# Altium schematic sheet 15_ISP.SchDoc: SPCA2688 ISP
size C; DocumentNumber: 9; SheetNumber: 9; SheetTotal: 12
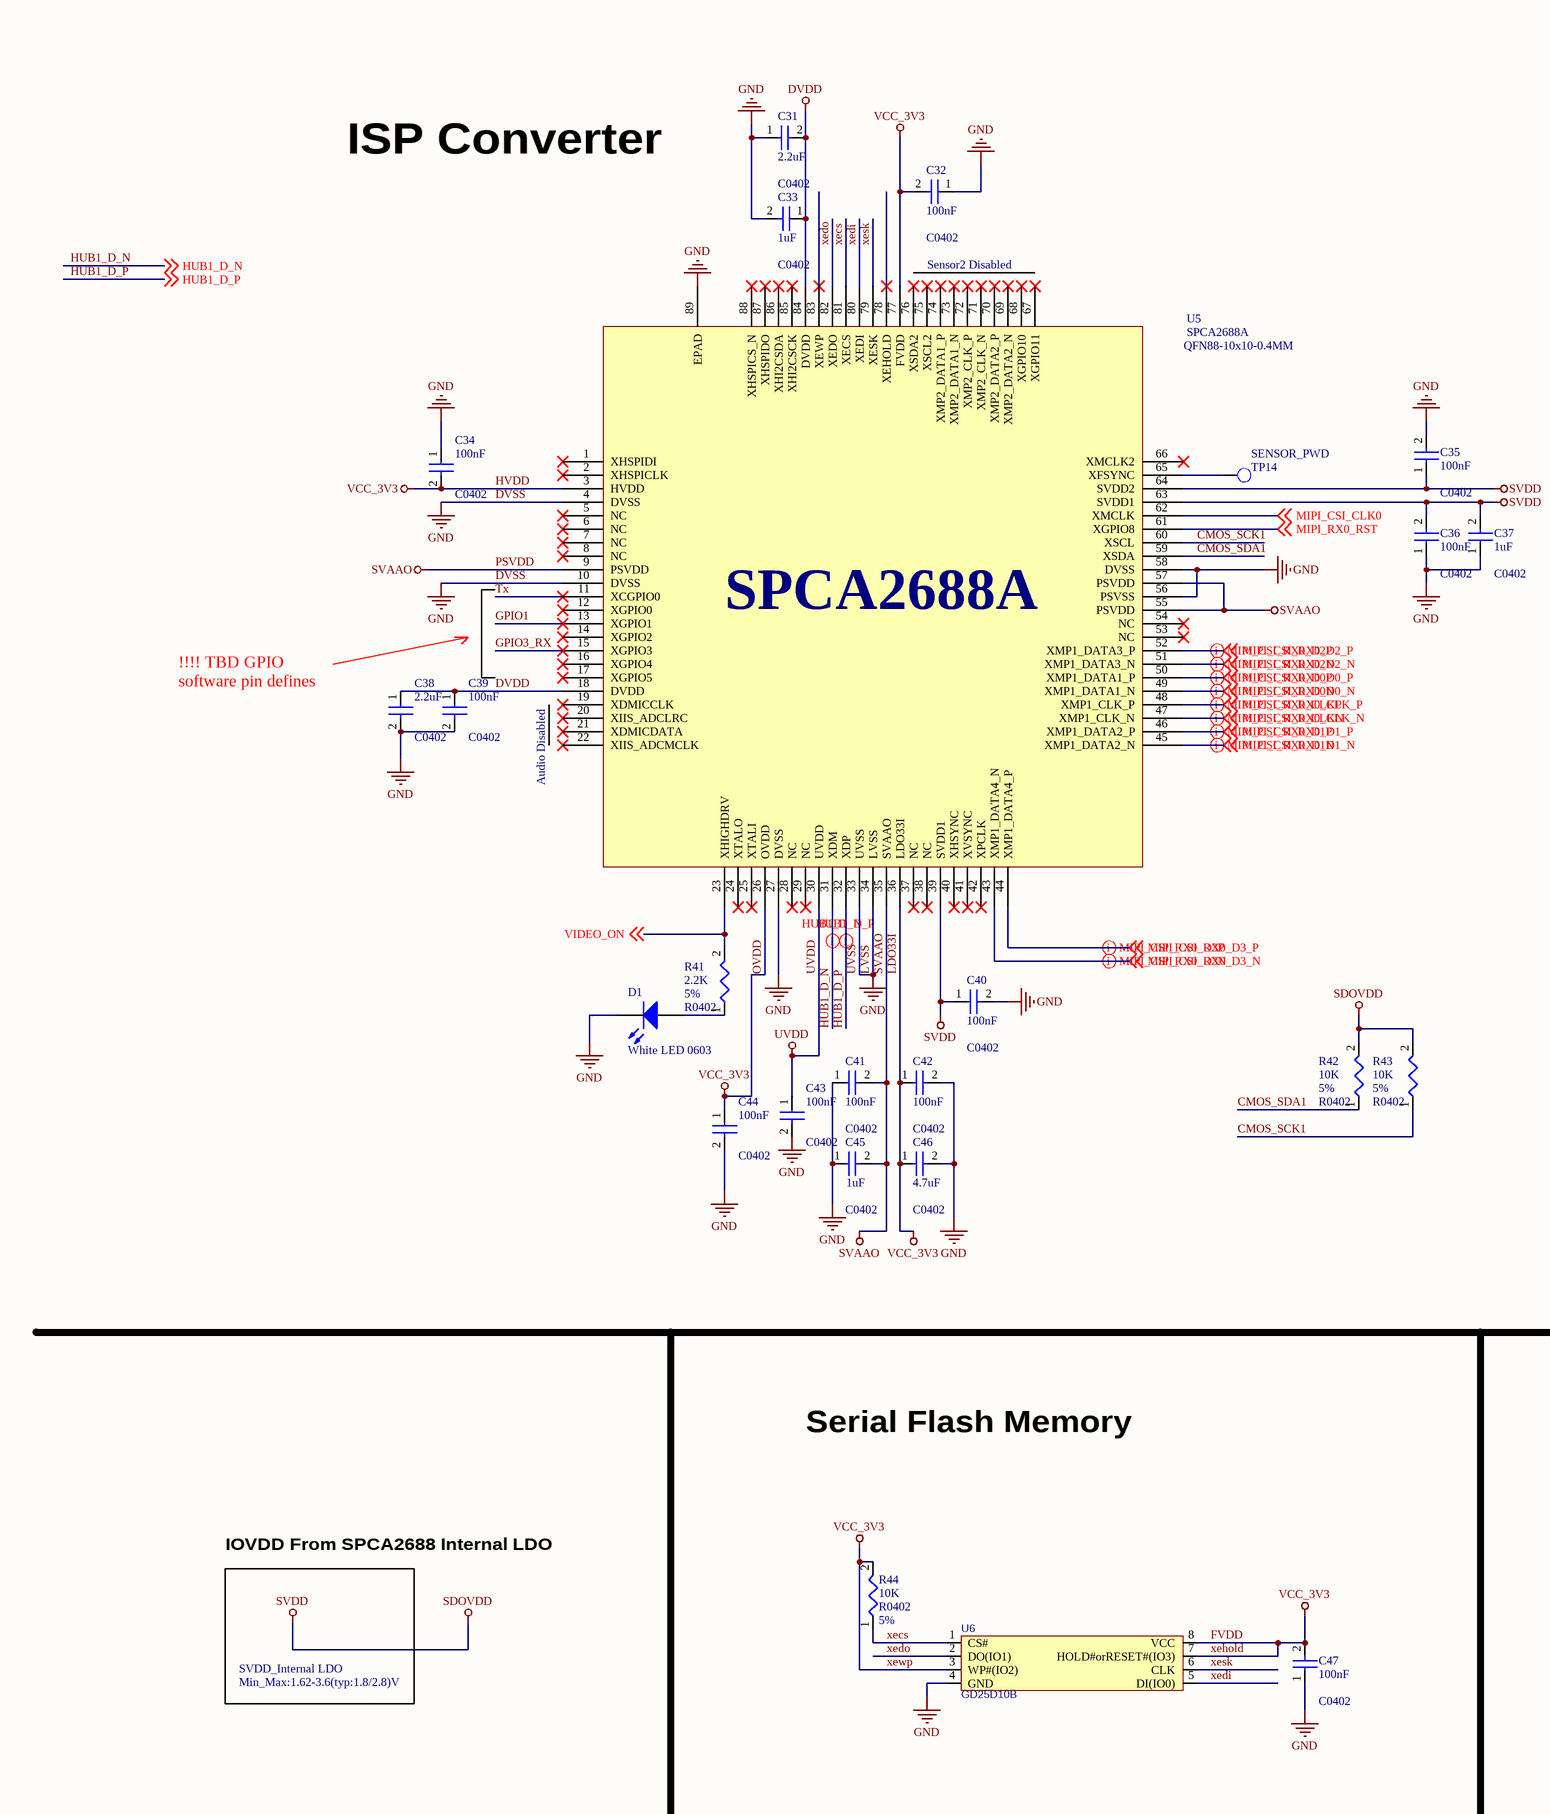
[diagram p0: 15_ISP.SchDoc, left]
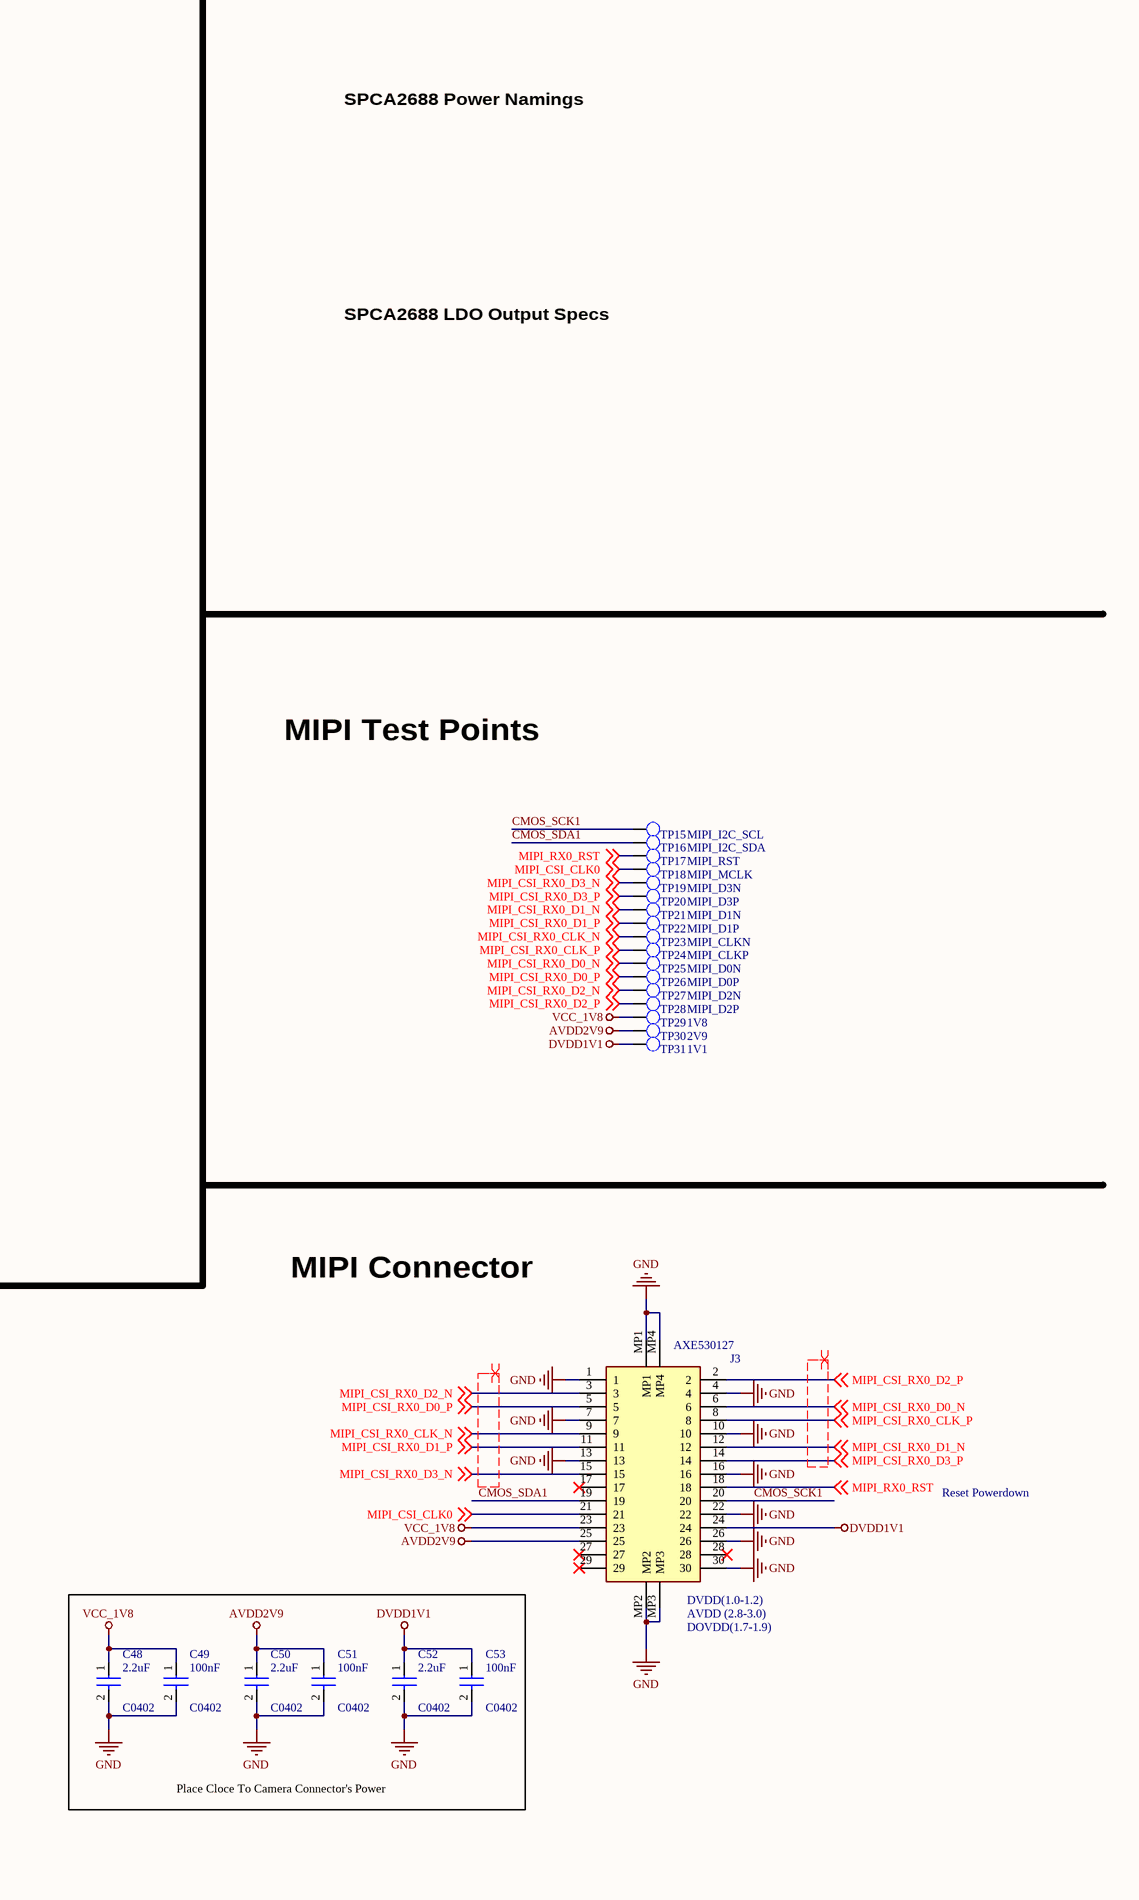
[diagram p1: 15_ISP.SchDoc, right]

## Parts
C31  2.2uF  PCB Footprint: C0402  [C0402_L]
C32  100nF  PCB Footprint: C0402  [C0402_L]
C33  1uF  PCB Footprint: C0402  [C0402_L]
C34  100nF  PCB Footprint: C0402  [C0402_L]
C35  100nF  PCB Footprint: C0402  [C0402_L]
C36  100nF  PCB Footprint: C0402  [C0402_L]
C37  1uF  PCB Footprint: C0402  [C0402_L]
C38  2.2uF  PCB Footprint: C0402  [C0402_L]
C39  100nF  PCB Footprint: C0402  [C0402_L]
C40  100nF  PCB Footprint: C0402  [C0402_L]
C41  100nF  PCB Footprint: C0402  [C0402_L]
C42  100nF  PCB Footprint: C0402  [C0402_L]
C43  100nF  PCB Footprint: C0402  [C0402_L]
C44  100nF  PCB Footprint: C0402  [C0402_L]
C45  1uF  PCB Footprint: C0402  [C0402_L]
C46  4.7uF  PCB Footprint: C0402  [C0402_L]
C47  100nF  PCB Footprint: C0402  [C0402_L]
C48  2.2uF  PCB Footprint: C0402  [C0402_L]
C49  100nF  PCB Footprint: C0402  [C0402_L]
C50  2.2uF  PCB Footprint: C0402  [C0402_L]
C51  100nF  PCB Footprint: C0402  [C0402_L]
C52  2.2uF  PCB Footprint: C0402  [C0402_L]
C53  100nF  PCB Footprint: C0402  [C0402_L]
D1  White LED 0603  [LED0603_W]
J3  AXE530127  [AXE530127_counterclock_pin]
R41  2.2K  Tolerance: 5%  [R0402]
R42  10K  Tolerance: 5%  [R0402]
R43  10K  Tolerance: 5%  [R0402]
R44  10K  Tolerance: 5%  [R0402]
TP14  SENSOR_PWD  [TP_0R70]  (no BOM)
TP15  MIPI_I2C_SCL  [TP_0R70]  (no BOM)
TP16  MIPI_I2C_SDA  [TP_0R70]  (no BOM)
TP17  MIPI_RST  [TP_0R70]  (no BOM)
TP18  MIPI_MCLK  [TP_0R70]  (no BOM)
TP19  MIPI_D3N  [TP_0R70]  (no BOM)
TP20  MIPI_D3P  [TP_0R70]  (no BOM)
TP21  MIPI_D1N  [TP_0R70]  (no BOM)
TP22  MIPI_D1P  [TP_0R70]  (no BOM)
TP23  MIPI_CLKN  [TP_0R70]  (no BOM)
TP24  MIPI_CLKP  [TP_0R70]  (no BOM)
TP25  MIPI_D0N  [TP_0R70]  (no BOM)
TP26  MIPI_D0P  [TP_0R70]  (no BOM)
TP27  MIPI_D2N  [TP_0R70]  (no BOM)
TP28  MIPI_D2P  [TP_0R70]  (no BOM)
TP29  1V8  [TP_0R70]  (no BOM)
TP30  2V9  [TP_0R70]  (no BOM)
TP31  1V1  [TP_0R70]  (no BOM)
U5  SPCA2688A  [QFN40P1000X1000X90-89N]
U6  GD25D10B  [SOIC-8]

## Blocks framed on the sheet
Place Cloce To Camera Connector's Power: C48-C53

## Nets
AVDD2V9: C50.1 C51.1 J3.25 TP30.1
DVDD: C31.2 C33.1 C38.1 C39.1 U5.18(DVDD) U5.84(DVDD)
DVDD1V1: C52.1 C53.1 J3.24 TP31.1
DVSS: C31.1 C32.1 C33.2 C34.1 C35.2 C36.1 C37.1 C38.2 C39.2 C40.2 C41.1 C42.2 C43.2 C44.2 C45.1 C46.2 C47.1 C48.2 C49.2 C50.2 C51.2 C52.2 C53.2 D1.2(K) J3.1 J3.4 J3.7 J3.10 J3.13 J3.16 J3.22 J3.26 J3.30 J3.MP1 J3.MP2 J3.MP3 J3.MP4 U5.4(DVSS) U5.10(DVSS) U5.27(DVSS) U5.33(UVSS) U5.34(LVSS) U5.56(PSVSS) U5.58(DVSS) U5.89(EPAD) U6.4(GND)  [also labelled GND, LVSS, UVSS]
FVDD: C32.2 C34.2 C42.1 C44.1 C46.1 C47.2 R44.2 U5.3(HVDD) U5.26(OVDD) U5.36(LDO33I) U5.77(FVDD) U6.3(WP#(IO2)) U6.7(HOLD#orRESET#(IO3)) U6.8(VCC)  [also labelled HVDD, LDO33I, OVDD, VCC_3V3, xehold, xewp]
PSVDD: C41.2 C45.2 U5.9(PSVDD) U5.35(SVAAO) U5.55(PSVDD) U5.57(PSVDD)  [also labelled SVAAO]
SDOVDD: C35.1 C36.2 C37.2 C40.1 R42.2 R43.2 U5.39(SVDD1) U5.63(SVDD1) U5.64(SVDD2)  [also labelled SVDD]
UVDD: C43.1 U5.30(UVDD)
VCC_1V8: C48.1 C49.1 J3.23 TP29.1
CMOS_SCK1: J3.20 R43.1 TP15.1 U5.60(XSCL)
CMOS_SDA1: J3.19 R42.1 TP16.1 U5.59(XSDA)
GPIO1: U5.13(XGPIO1)
GPIO3_RX: U5.15(XGPIO3)
HUB1_D_N: U5.31(XDM) ; off-sheet HUB1_D_N
HUB1_D_P: U5.32(XDP) ; off-sheet HUB1_D_P
MIPI_CSI_CLK0: J3.21 TP18.1 U5.62(XMCLK) ; off-sheet MIPI_CSI_CLK0
MIPI_CSI_RX0_CLK_N: J3.9 TP23.1 U5.47(XMP1_CLK_N) ; off-sheet MIPI_CSI_RX0_CLK_N
MIPI_CSI_RX0_CLK_P: J3.8 TP24.1 U5.48(XMP1_CLK_P) ; off-sheet MIPI_CSI_RX0_CLK_P
MIPI_CSI_RX0_D0_N: J3.6 TP25.1 U5.49(XMP1_DATA1_N) ; off-sheet MIPI_CSI_RX0_D0_N
MIPI_CSI_RX0_D0_P: J3.5 TP26.1 U5.50(XMP1_DATA1_P) ; off-sheet MIPI_CSI_RX0_D0_P
MIPI_CSI_RX0_D1_N: J3.12 TP21.1 U5.45(XMP1_DATA2_N) ; off-sheet MIPI_CSI_RX0_D1_N
MIPI_CSI_RX0_D1_P: J3.11 TP22.1 U5.46(XMP1_DATA2_P) ; off-sheet MIPI_CSI_RX0_D1_P
MIPI_CSI_RX0_D2_N: J3.3 TP27.1 U5.51(XMP1_DATA3_N) ; off-sheet MIPI_CSI_RX0_D2_N
MIPI_CSI_RX0_D2_P: J3.2 TP28.1 U5.52(XMP1_DATA3_P) ; off-sheet MIPI_CSI_RX0_D2_P
MIPI_CSI_RX0_D3_N: J3.15 TP19.1 U5.43(XMP1_DATA4_N) ; off-sheet MIPI_CSI_RX0_D3_N
MIPI_CSI_RX0_D3_P: J3.14 TP20.1 U5.44(XMP1_DATA4_P) ; off-sheet MIPI_CSI_RX0_D3_P
MIPI_RX0_RST: J3.18 TP17.1 U5.61(XGPIO8) ; off-sheet MIPI_RX0_RST
Tx: U5.11(XCGPIO0)
VIDEO_ON: R41.2 U5.23(XHIGHDRV) ; off-sheet VIDEO_ON
xecs: R44.1 U5.81(XECS) U6.1(CS#)
xedi: U5.80(XEDI) U6.5(DI(IO0))
xedo: U5.82(XEDO) U6.2(DO(IO1))
xesk: U5.79(XESK) U6.6(CLK)
NetD1_1: D1.1(A) R41.1
NetTP14_1: TP14.1 U5.65(XFSYNC)

Not connected (* = marked no-connect by the designer): J3 17* 27* 28* 29*; U5 1(XHSPIDI)* 2(XHSPICLK)* 5(NC)* 6(NC)* 7(NC)* 8(NC)* 12(XGPIO0)* 14(XGPIO2)* 16(XGPIO4)* 17(XGPIO5)* 19(XDMICCLK)* 20(XIIS_ADCLRC)* 21(XDMICDATA)* 22(XIIS_ADCMCLK)* 24(XTALO)* 25(XTALI)* 28(NC)* 29(NC)* 37(NC)* 38(NC)* 40(XHSYNC)* 41(XVSYNC)* 42(XPCLK)* 53(NC)* 54(NC)* 66(XMCLK2)* 67(XGPIO11)* 68(XGPIO10)* 69(XMP2_DATA2_N)* 70(XMP2_DATA2_P)* 71(XMP2_CLK_N)* 72(XMP2_CLK_P)* 73(XMP2_DATA1_N)* 74(XMP2_DATA1_P)* 75(XSCL2)* 76(XSDA2)* 78(XEHOLD)* 83(XEWP)* 85(XHI2CSCK)* 86(XHI2CSDA)* 87(XHSPIDO)* 88(XHSPICS_N)*

## Layout directives
differential pair; differential pair class USB; net class USB: HUB1_D_N, HUB1_D_P
differential pair; net class MIPI; differential pair class MIPI: MIPI_CSI_RX0_CLK_N, MIPI_CSI_RX0_CLK_P, MIPI_CSI_RX0_D0_N, MIPI_CSI_RX0_D0_P, MIPI_CSI_RX0_D1_N, MIPI_CSI_RX0_D1_P, MIPI_CSI_RX0_D2_N, MIPI_CSI_RX0_D2_P, MIPI_CSI_RX0_D3_N, MIPI_CSI_RX0_D3_P
differential pair: (no net found under the mark)

## Notes on the sheet
- SPCA2688 Power Namings
- ISP Converter
- Sensor2 Disabled
- (near U5) QFN88-10x10-0.4MM
- SPCA2688 LDO Output Specs
- !!!! TBD GPIO software pin defines
- Audio Disabled
- MIPI Test Points
- MIPI Connector
- Serial Flash Memory
- IOVDD From SPCA2688 Internal LDO
- Reset Powerdown
- SVDD_Internal LDO
- Min_Max:1.62-3.6(typ:1.8/2.8)V
- (near J3) DVDD(1.0-1.2)
- (near J3) AVDD (2.8-3.0)
- (near J3) DOVDD(1.7-1.9)
- Title
- Size:
- Date:
- File:
- C
- Number:
- Time:
- Revision:
- Sheet
- of
- Author: Edward Lai
- Email: edward@vibe.us
- Vibe Inc
- Hangzhou
- vibe.us <http://vibe.us>

## Library data of the parts
C31 C38 C48 C50 C52 = CAP NP_Dup1: cap,2.20uF,+/-10%,10V,X5R,C0402; Priority: A; Part Type: C0402
C32 C34-C36 C39-C44 C47 C49 C51 C53 = CAP NP_Dup1: cap,100.00nF,+/-10%,25V,X5R,C0402; Priority: A; Part Type: C0402
C33 C37 = CAP NP_Dup1: cap,1.00uF,+/-10%,6.3V,X5R,C0402; Priority: A; Part Type: C0402
C45 = CAP NP_Dup1: cap,1.00uF,+/-10%,10V,X5R,C0402; Priority: A; Part Type: C0402
C46 = CAP NP_Dup1: cap,4.70uF,+/-10%,6.3V,X5R,C0402; Priority: A; Part Type: C0402
D1 = LED: LED 0603 Wite 发光二极管; Part Type: SS14
J3 = AXE530127: AXE530127 Connector; Manufacturer_Name: Panasonic; Datasheet Link: https://componentsearchengine.com//AXE530127.pdf; Height: 0.97mm; Mouser2 Part Number: 679-AXE530127; Mouser2 Price/Stock: https://www.mouser.com/Search/Refine.aspx?Keyword=679-AXE530127; Manufacturer_Part_Number: AXE530127
R41 = RESISTOR: 通用厚膜电阻,2.2K,+/-5%,R0402; Priority: A; PCB Footprint: R0402; Part Type: 通用厚膜电阻
R42-R44 = RESISTOR: 通用厚膜电阻,10K,+/-5%,R0402; Priority: A; PCB Footprint: R0402; Part Type: 通用厚膜电阻
TP14-TP31 = TP: Test Point 0.7mm; PCB Footprint: TP_0R50; Priority: A; Part Type: TP
U5 = SPCA2688A: SPCA2688A ISP IC / QFN88 10x10MM 0.4MM
U6 = GD25D10B: SPI FLASH SOP-8